# EAGLE schematic openmv-cc (EAGLE 6.1)
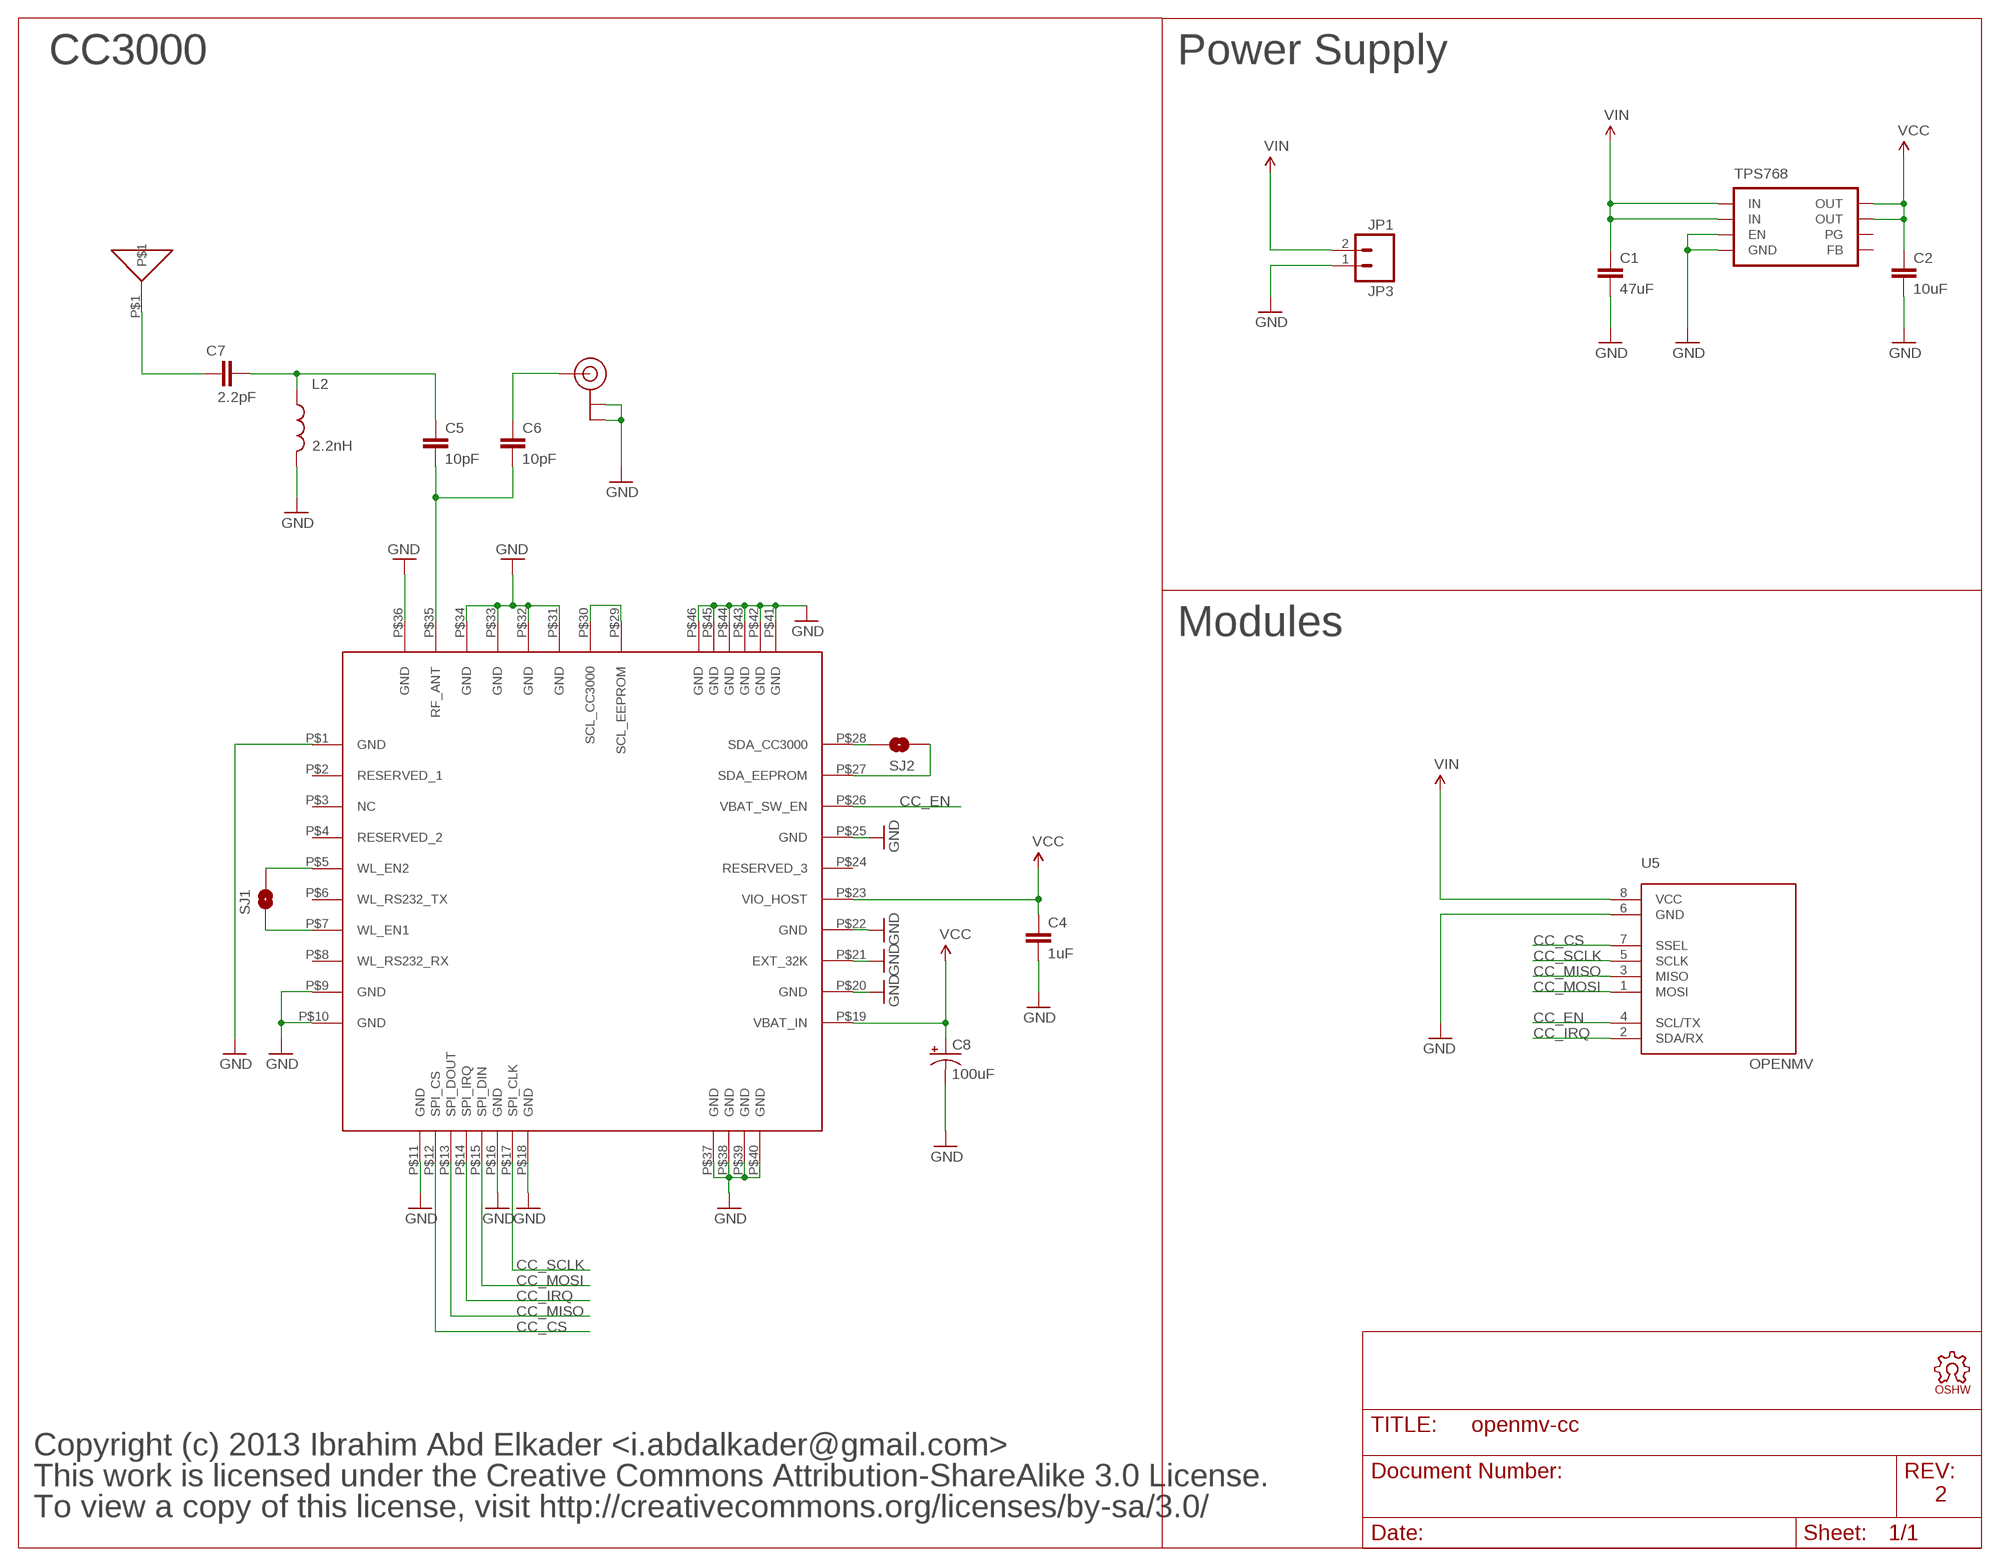
[diagram p0: schematic, sheet 1]

## Parts
C1  47uF  CAP1210  [1210]
C2  10uF  CAP0805  [0805]
C4  1uF  CAP0402-CAP  [0402-CAP]
C5  10pF  CAP0402-CAP  [0402-CAP]
C6  10pF  CAP0402-CAP  [0402-CAP]
C7  2.2pF  CAP0402-CAP  [0402-CAP]
C8  100uF  CAP_POL3528  [EIA3528]
JP1  JP3  M02JST-PTH-2  [JST-2-PTH]
L2  2.2nH  INDUCTOR0402  [C0402]
LOGO1  OSHW_LOGO_FILLX0100-NT  [OSHW_FILLX100_NOTEXT]
SJ1  SOLDERJUMPERTRACE  [SJ_2S-TRACE]
SJ2  SOLDERJUMPERTRACE  [SJ_2S-TRACE]
U1  CC3000  [CC3000]
U2  ANT-YAGEO  [ANTENNA]
U3  U.FL  [U.FL]
U4  TPS768  [SOIC8]
U5  OPENMV  [OPENMV]

## Nets
CC_CS: U1.P$12(SPI_CS) U5.7(SSEL)
CC_EN: U1.P$26(VBAT_SW_EN) U5.4(SCL/TX)
CC_IRQ: U1.P$14(SPI_IRQ) U5.2(SDA/RX)
CC_MISO: U1.P$13(SPI_DOUT) U5.3(MISO)
CC_MOSI: U1.P$15(SPI_DIN) U5.1(MOSI)
CC_SCLK: U1.P$17(SPI_CLK) U5.5(SCLK)
GND: C1.2 C2.2 C4.2 C8.C(-) JP1.1 L2.2 U1.P$1(GND) U1.P$9(GND) U1.P$10(GND) U1.P$11(GND) U1.P$16(GND) U1.P$18(GND) U1.P$20(GND) U1.P$21(EXT_32K) U1.P$22(GND) U1.P$25(GND) U1.P$31(GND) U1.P$32(GND) U1.P$33(GND) U1.P$34(GND) U1.P$36(GND) U1.P$37(GND) U1.P$38(GND) U1.P$39(GND) U1.P$40(GND) U1.P$41(GND) U1.P$42(GND) U1.P$43(GND) U1.P$44(GND) U1.P$45(GND) U1.P$46(GND) U3.P$1(GND) U3.P$2(GND) U4.1(GND) U4.2(EN) U5.6(GND)
N$1: C5.1 C7.2 L2.1
N$3: SJ1.2 U1.P$5(WL_EN2)
N$4: SJ2.2 U1.P$28(SDA_CC3000)
N$5: SJ1.1 U1.P$7(WL_EN1)
N$6: SJ2.1 U1.P$27(SDA_EEPROM)
N$13: C5.2 C6.2 U1.P$35(RF_ANT)
N$14: U1.P$29(SCL_EEPROM) U1.P$30(SCL_CC3000)
N$15: C7.1 U2.P$1
N$23: C6.1 U3.P$3(SIGNAL)
VCC: C2.1 C4.1 C8.A(+) U1.P$19(VBAT_IN) U1.P$23(VIO_HOST) U4.5(OUT) U4.6(OUT)
VIN: C1.1 JP1.2 U4.3(IN) U4.4(IN) U5.8(VCC)
Unconnected: U1.P$2(RESERVED_1) U1.P$3(NC) U1.P$4(RESERVED_2) U1.P$6(WL_RS232_TX) U1.P$8(WL_RS232_RX) U1.P$24(RESERVED_3) U4.7(FB) U4.8(PG)

## Notes on the sheet
- CC3000 | Power Supply
- Modules
- Copyright (c) 2013 Ibrahim Abd Elkader <i.abdalkader@gmail.com>
- This work is licensed under the Creative Commons Attribution-ShareAlike 3.0 License.
- 2
- To view a copy of this license, visit http://creativecommons.org/licenses/by-sa/3.0/

## Library data of the parts
C1 C2 C4-C7 = sfe:CAP: Capacitor Standard 0603 ceramic capacitor, and 0.1" leaded capacitor.
C8 = sfe:CAP_POL: Capacitor Polarized These are standard SMD and PTH capacitors. Normally 10uF, 47uF, and 100uF in electrolytic and tantalum varieties. Always verify the external diameter of the through hole cap, it varies with capacity, voltage, and manufacturer. The EIA devices should be standard.
JP1 = sfe:M02: Header 2 Standard 2-pin 0.1" header. Use with straight break away headers (SKU : PRT-00116), right angle break away headers (PRT-00553), swiss pins (PRT-00743), machine pins (PRT-00117), and female headers (PRT-00115). Molex polarized connector foot print use with SKU : PRT-08233 with associated crimp pins and housings.
L2 = iofault:INDUCTOR: Inductors Basic Inductor/Choke - 0603 and 1206. Footprints are not proven and vary greatly between part numbers.
LOGO1 = iofault:OSHW_LOGO_FILL
SJ1 SJ2 = sfe:SOLDERJUMPER: Solder Jumper Standard SMD solder jumper. Used to automate production. Two varients : Normally Open and Normally Closed are the same, but have different paste layers. NC will have a large amount of paste and should jumper during reflow.
U1 = CC3000:CC3000: TI SimpleLink CC3000 Module - WiFi 802.11b/g Network Processor; AUTHOR: Matt Bigarani; DATASHEET: http://www.ti.com/lit/ds/symlink/cc3000.pdf; DATE: 2/8/2013
U2 = CC3000:ANT-YAGEO
U3 = sfe:U.FL
U4 = mux:TPS768
U5 = openmv:OPENMV

## Net classes
1 vcc: width 1.016 mm, clearance 0.203 mm
2 antenna: width 0.363 mm, clearance 0.305 mm
3 1.8v: width 0.457 mm, clearance 0.254 mm